# EAGLE design FrontendModulev2 (EAGLE 6.6.0)
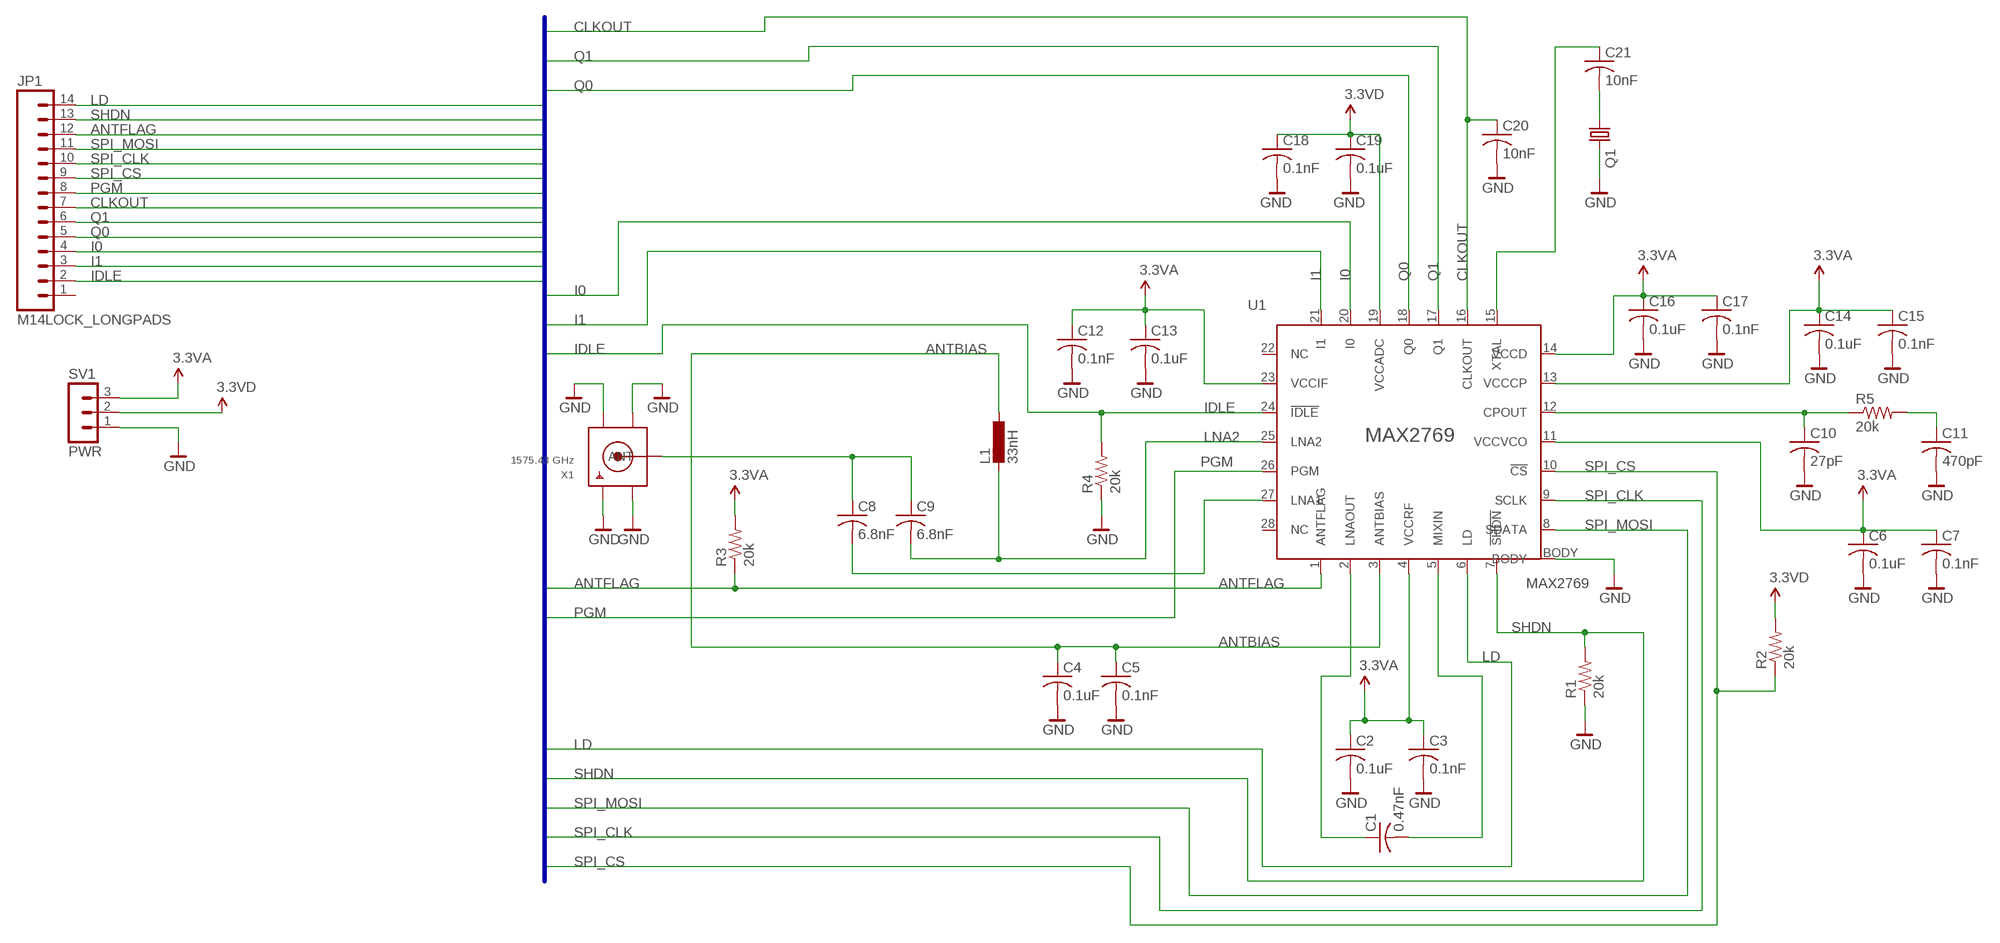
[diagram p0: schematic, sheet 1]

## Parts
C1  0.47nF  C-USC0805K  [C0805K]
C2  0.1uF  C-USC0805K  [C0805K]
C3  0.1nF  C-USC0805K  [C0805K]
C4  0.1uF  C-USC0805K  [C0805K]
C5  0.1nF  C-USC0805K  [C0805K]
C6  0.1uF  C-USC0805K  [C0805K]
C7  0.1nF  C-USC0805K  [C0805K]
C8  6.8nF  C-USC0805K  [C0805K]
C9  6.8nF  C-USC0805K  [C0805K]
C10  27pF  C-USC0805K  [C0805K]
C11  470pF  C-USC0805K  [C0805K]
C12  0.1nF  C-USC0805K  [C0805K]
C13  0.1uF  C-USC0805K  [C0805K]
C14  0.1uF  C-USC0805K  [C0805K]
C15  0.1nF  C-USC0805K  [C0805K]
C16  0.1uF  C-USC0805K  [C0805K]
C17  0.1nF  C-USC0805K  [C0805K]
C18  0.1nF  C-USC0805K  [C0805K]
C19  0.1uF  C-USC0805K  [C0805K]
C20  10nF  C-USC0805K  [C0805K]
C21  10nF  C-USC0805K  [C0805K]
JP1  M14LOCK_LONGPADS  [1X14_LOCK_LONGPADS]
L1  33nH  L-EUL2012C  [L2012C]
Q1  CRYSTALCTS406  [CTS406]
R1  20k  R-US_R0805  [R0805]
R2  20k  R-US_R0805  [R0805]
R3  20k  R-US_R0805  [R0805]
R4  20k  R-US_R0805  [R0805]
R5  20k  R-US_R0805  [R0805]
SV1  PWR  MA03-1  [MA03-1]
U1  MAX2769  [90-0023]
X1  1575.43 GHz  SMACONNECTOR  [SMA90_DIP]

## Nets
3.3VA: C2.1 C3.1 C6.1 C7.1 C12.1 C13.1 C14.1 C15.1 C16.1 C17.1 R3.2 SV1.3 U1.4(VCCRF) U1.11(VCCVCO) U1.13(VCCCP) U1.14(VCCD) U1.23(VCCIF)
3.3VD: C18.1 C19.1 R2.2 SV1.2 U1.19(VCCADC)
ANTBIAS: C4.1 C5.1 L1.1 U1.3(ANTBIAS)
ANTFLAG: JP1.12 R3.1 U1.1(ANTFLAG)
BAR_GND: C2.2 C3.2 C4.2 C5.2 C6.2 C7.2 C10.2 C11.2 C12.2 C13.2 C14.2 C15.2 C16.2 C17.2 C18.2 C19.2 C20.2 Q1.3 R1.1 R4.1 SV1.1 U1.BODY X1.GND1 X1.GND2 X1.GND3 X1.GND4 ; supply symbol labelled GND
CLKOUT: C20.1 JP1.7 U1.16(CLKOUT)
I0: JP1.4 U1.20(I0)
I1: JP1.3 U1.21(I1)
IDLE: JP1.2 R4.2 U1.24(!IDLE)
LD: JP1.14 U1.6(LD)
LNA1: C8.2 U1.27(LNA1)
LNA2: C9.2 L1.2 U1.25(LNA2)
N$1: C8.1 C9.1 X1.ANTENNA(ANT)
N$2: C1.2 U1.5(MIXIN)
N$3: C21.2 Q1.1
N$35: C10.1 R5.1 U1.12(CPOUT)
N$36: C11.1 R5.2
N$41: C1.1 U1.2(LNAOUT)
N$44: C21.1 U1.15(XTAL)
PGM: JP1.8 U1.26(PGM)
Q0: JP1.5 U1.18(Q0)
Q1: JP1.6 U1.17(Q1)
SHDN: JP1.13 R1.2 U1.7(!SHDN)
SPI_CLK: JP1.10 U1.9(SCLK)
SPI_CS: JP1.9 R2.1 U1.10(!CS)
SPI_MOSI: JP1.11 U1.8(SDATA)
Unconnected: JP1.1 U1.22(NC) U1.28(NC)

## Buses
Q0,Q1,I0,I1,IDLE,ANTFLAG,PGM,LD,SHDN,SPI_MOSI,SPI_CLK,SPI_CS,CLKOUT

## Library data of the parts
C1-C21 = adafruit:C-US: CAPACITOR, American symbol
JP1 = SparkFun-Connectors:M14: Header 14 Standard 14-pin 0.1" header. Use with straight break away headers (SKU : PRT-00116), right angle break away headers (PRT-00553), swiss pins (PRT-00743), machine pins (PRT-00117), and female headers (PRT-00115).
L1 = rcl:L-EU: INDUCTOR, European symbol
Q1 = crystal:CRYSTAL: CRYSTAL; OC_FARNELL: unknown; OC_NEWARK: unknown
R1-R5 = adafruit:R-US_: RESISTOR, American symbol
SV1 = con-lstb:MA03-1: PIN HEADER; OC_FARNELL: unknown; OC_NEWARK: unknown
U1 = wicker:MAX2769: MAX2769 Universal GPS Receiver IC Package Land Pattern [T2855-3/T2855-3+] http://pdfserv.maxim-ic.com/land_patterns/90-0023.PDF Thin Quad Flatpack, No Leads http://pdfserv.maxim-ic.com/package_dwgs/21-0140.PDF Related Datasheet http://www.maxim-ic.com/datasheet/index.mvp/id/5241
X1 = adafruit:SMACONNECTOR: SMA Connector 90° DIP SMA Connector, 50 Ohm (4UConnector: 07259)

## Board
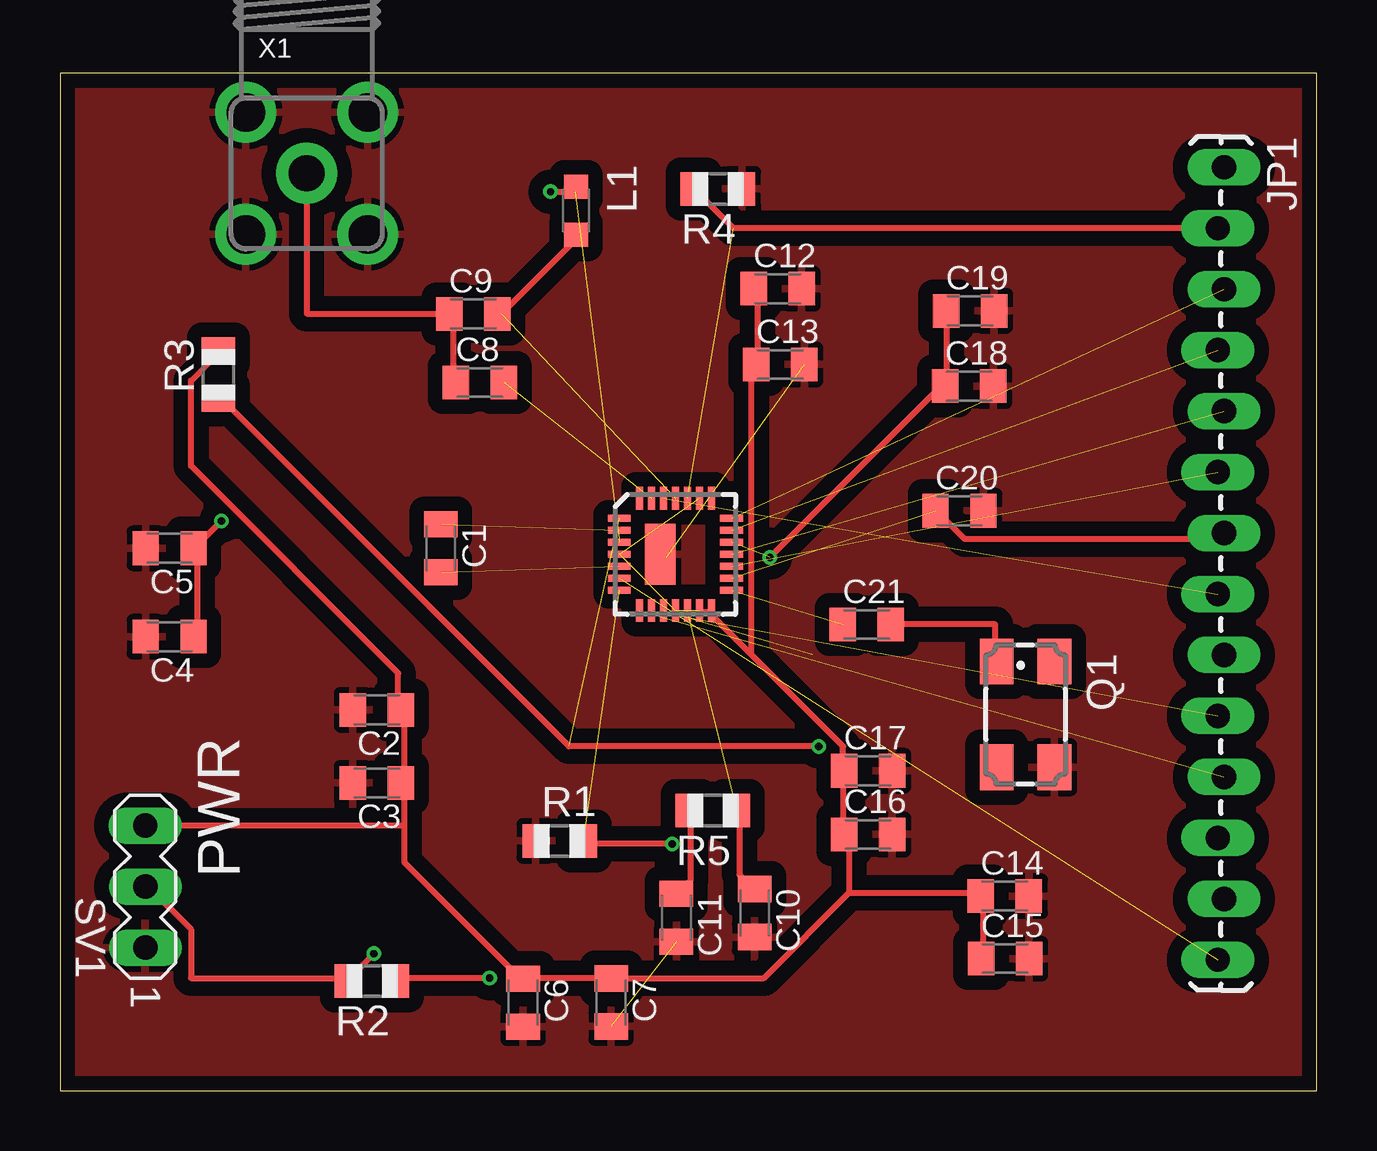
[diagram p1: board, top side]
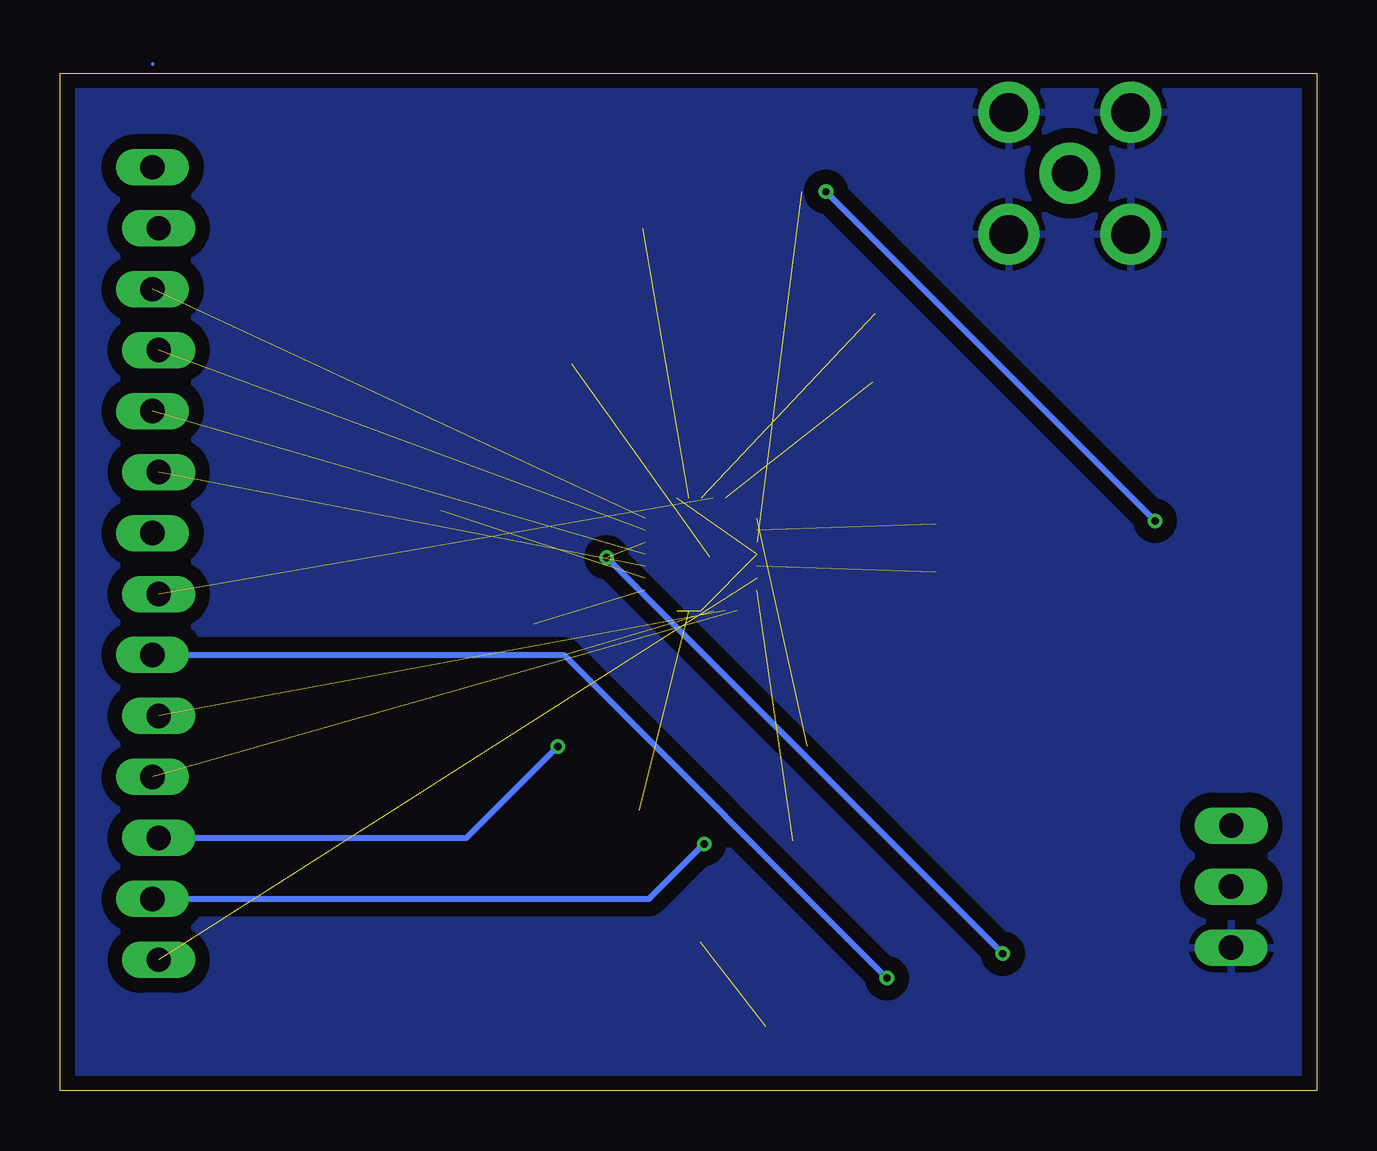
[diagram p2: board, bottom side, seen from below]

Size 52.38 x 42.41 mm. Coordinates in mm from the lower left corner, seen from the top.
Outline: 0,0 52.38,0 52.38,42.41 0,42.41 0,0
Copper layers (1*16): Top 0.035mm / dielectric 1.5mm / Bottom 0.035mm
Design rules "SeeedStudio_2layer_DRU_no_angle_20140221 *": minimum track width 10mil, minimum drill 12mil, track to track 6mil, track to pad 6mil, pad to pad 6mil, via to via 6mil, smd to smd 0mil, copper to edge 10mil, drill to drill 10mil, minimum pad ring 10mil, minimum via ring 6mil, stop-mask expansion 2mil, vias tented up to drill 100mil, thermal gap 10mil

### Footprints (pad centres in the part's own frame; a part is rotated, then mirrored left to right if it is on the bottom)
C0805K = smd 1.1 x 1.4: 1 -1,0; 2 1,0
1X14_LOCK_LONGPADS = drill 1.016 long: 1 0,0.127; 2 2.54,-0.127; 3 5.08,0.127; 4 7.62,-0.127; 5 10.16,0.127; 6 12.7,-0.127; 7 15.24,0.127; 8 17.78,-0.127; 9 20.32,0.127; 10 22.86,-0.127; 11 25.4,0.127; 12 27.94,-0.127; 13 30.48,0.127; 14 33.02,-0.127
L2012C = smd 1 x 1: 1 -1,0; 2 1,0
CTS406 = smd 1.9 x 1.4: 1 -2.2,-1.2; 2 2.2,-1.2; 3 2.2,1.2; 4 -2.2,1.2
R0805 = smd 1.1 x 1.4: 1 -1,0; 2 1,0
MA03-1 = drill 1.016 long: 1 -2.54,0; 2 0,0; 3 2.54,0
90-0023 = smd 0.3 x 0.95: 1 -1.5,-2.34; 2 -1,-2.34; 3 -0.5,-2.34; 4 0,-2.34; 5 0.5,-2.34; 6 1,-2.34; 7 1.5,-2.34; 15 1.5,2.34; 16 1,2.34; 17 0.5,2.34; 18 0,2.34; 19 -0.5,2.34; 20 -1,2.34; 21 -1.5,2.34 | smd 0.95 x 0.3: 8 2.34,-1.5; 9 2.34,-1; 10 2.34,-0.5; 11 2.34,0; 12 2.34,0.5; 13 2.34,1; 14 2.34,1.5; 22 -2.34,1.5; 23 -2.34,1; 24 -2.34,0.5; 25 -2.34,0; 26 -2.34,-0.5; 27 -2.34,-1; 28 -2.34,-1.5 | smd 2.54 x 1.27: BODY 0,-0.635
SMA90_DIP = drill 1.5 pad 2.54: ANTENNA 0,0 | drill 1.6 pad 2.54: GND1 -2.54,2.54; GND2 2.54,2.54; GND3 -2.54,-2.54; GND4 2.54,-2.54

### Placement (x,y rotation side)
C1  15.88,22.61 270 top
C2  13.21,15.88 180 top
C3  13.21,12.83 180 top
C4  4.57,18.92 180 top
C5  4.57,22.61 180 top
C6  19.3,3.67 270 top
C7  22.97,3.68 270 top
C8  17.5,29.51 0 top
C9  17.22,32.37 0 top
C10  28.96,7.4 270 top
C11  25.69,7.21 270 top
C12  29.91,33.43 0 top
C13  30.02,30.26 0 top
C14  39.38,8.12 0 top
C15  39.4,5.51 0 top
C16  33.68,10.68 0 top
C17  33.68,13.34 0 top
C18  37.9,29.36 0 top
C19  37.93,32.5 0 top
C20  37.49,24.17 0 top
C21  33.63,19.43 0 top
JP1  48.39,38.48 270 top
L1  21.51,36.68 270 top
Q1  40.25,15.68 270 top
R1  20.83,10.41 0 top
R2  13,4.58 180 top
R3  6.6,29.85 90 top
R4  27.42,37.58 180 top
R5  27.22,11.68 180 top
SV1  3.56,8.51 90.1 top
U1  25.65,22.35 270 top
X1  10.29,38.23 0 top

### Tracks (layer width: path | path; a pad name or v marks a point on that pad's centre or on a via)
3.3VA  (3 unrouted)
  Top 0.254: C12.1 29.08,33.4 29.08,30.35 C13.1 28.83,30.1 28.83,18.16 | C15.1 38.48,5.71 38.48,8 C14.1 38.23,8.26 32.89,8.26 | 27.05,19.94 26.8,19.94 U1.13 | 28.83,18.16 32.64,14.35 32.64,13.34 | 28.83,18.16 27.05,19.94 | 27.05,19.94 U1.14 | 32.64,13.34 32.64,10.8 C16.1 32.89,10.54 32.89,8.26 | 32.64,13.34 C17.1 | 14.35,12.83 14.35,15.88 C2.1 14.1,15.88 14.1,17.4 5.46,26.04 5.46,29.59 6.48,30.61 R3.2 | 14.35,12.83 14.35,11.05 | 14.35,11.05 14.35,9.53 19.18,4.7 C6.1 19.43,4.7 22.73,4.7 C7.1 22.99,4.7 29.34,4.7 32.89,8.26 | 14.35,12.83 C3.1 | 14.35,11.05 3.68,11.05 SV1.3
3.3VD  (via drill 0.3)  (1 unrouted)
  Top 0.254: C19.1 36.96,32.39 36.96,29.59 C18.1 36.7,29.34 v29.59,22.23 | SV1.2 3.68,8.51 5.46,6.73 5.46,4.7 11.81,4.7 R2.2 12.06,4.7 v13.08,5.71
  Bottom 0.254: v13.08,5.71 v29.59,22.23
ANTBIAS  (via drill 0.3)  (1 unrouted)
  Top 0.254: v20.45,37.47 21.46,37.47 L1.1 | v6.73,23.75 5.71,22.73 C5.1 5.71,22.48 5.71,18.92 C4.1
  Bottom 0.254: v6.73,23.75 v20.45,37.47
ANTFLAG  (via drill 0.3)  (1 unrouted)
  Top 0.254: v31.62,14.35 21.21,14.35 6.73,28.83 R3.1
  Bottom 0.254: v31.62,14.35 35.43,10.54 JP1.12
BAR_GND  (2 unrouted)
  Top 0.254: 25.27,22.23 U1.BODY
  pour Bottom (isolate 0.61): 0,42.42 52.45,42.42 52.45,0 0,0
  pour Top (isolate 0.61): 0,42.42 52.45,42.42 52.45,0 0,0
CLKOUT  (1 unrouted)
  Top 0.254: C20.1 36.7,24 37.72,22.99 48.39,22.99 48.39,23.24 JP1.7
GND
  Bottom 0.152: 48.51,42.8 48.51,42.77
I0  (1 unrouted)
I1  (1 unrouted)
IDLE  (1 unrouted)
  Top 0.254: JP1.2 28.07,35.94 26.54,37.47 R4.2
LD  (1 unrouted)
LNA1  (1 unrouted)
LNA2  (1 unrouted)
  Top 0.254: L1.2 21.46,35.43 18.41,32.39 C9.2
N$1
  Top 0.254: C8.1 16.38,29.59 16.38,32.13 C9.1 16.13,32.39 10.29,32.39 X1.ANTENNA
N$2  (1 unrouted)
N$3
  Top 0.254: C21.2 38.99,19.43 38.99,17.91 Q1.1
N$35  (1 unrouted)
  Top 0.254: C10.1 28.83,8.51 28.32,9.02 28.32,11.56 R5.1
N$36
  Top 0.254: C11.1 25.78,8.26 26.29,8.76 26.29,11.56 R5.2
N$41  (1 unrouted)
N$44  (1 unrouted)
PGM  (1 unrouted)
Q0  (1 unrouted)
Q1  (1 unrouted)
SHDN  (via drill 0.3)  (1 unrouted)
  Top 0.254: v25.53,10.29 21.97,10.29 R1.2
  Bottom 0.254: v25.53,10.29 27.81,8 JP1.13
SPI_CLK  (1 unrouted)
SPI_CS  (via drill 0.3)  (1 unrouted)
  Top 0.254: v17.91,4.7 14.1,4.7 R2.1
  Bottom 0.254: v17.91,4.7 31.37,18.16 JP1.9
SPI_MOSI  (1 unrouted)

### Text on the board
tNames: PWR